# Altium schematic sheet Sheet1.SchDoc
size 209 x 297 mm; Scale: 1:1; Разраб.: Косяков Д.; Пров.: Гюльмалиев Э.; Утв.: Гюльмалиев Э.; Номер листа: 2; Общее количество листов: 2; Наименование организации: ГБПОУ "1-й МОК"; Наименование изделия 1: Плата; Наименование изделия 2: Схема электрическая; Наименование изделия 3: принципиальная; Нач. отд.: Науч.рук; Фамилия нач. отд.: Гюльмалиев Э.
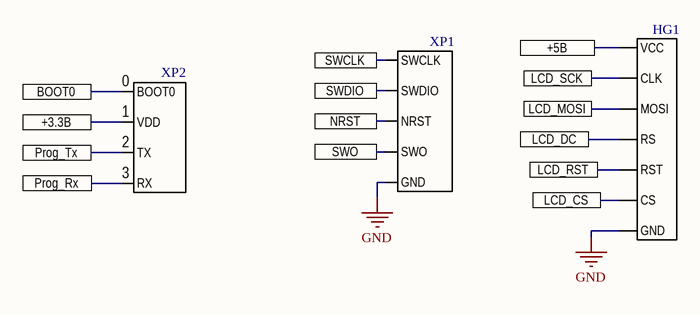
[diagram p0: Sheet1.SchDoc]

## Parts
HG1  TFT_SPI  [LCD_TFT_SPI]  (value not drawn)
XP1  SWD  [SWD]  (value not drawn)
XP2  UART  [UART]  (value not drawn)

## Ports
+3.3В, +5В, BOOT0, LCD_CS, LCD_DC, LCD_MOSI, LCD_RST, LCD_SCK, NRST, Prog_Rx, Prog_Tx, SWCLK, SWDIO, SWO

## Nets
GND: HG1.2(GND) XP1.1(GND)
+3.3В: XP2.1(VDD) ; port +3.3В
+5В: HG1.1(VCC) ; port +5В
BOOT0: XP2.0(BOOT0) ; port BOOT0
LCD_CS: HG1.7(CS) ; port LCD_CS
LCD_DC: HG1.5(RS) ; port LCD_DC
LCD_MOSI: HG1.4(MOSI) ; port LCD_MOSI
LCD_RST: HG1.6(RST) ; port LCD_RST
LCD_SCK: HG1.3(CLK) ; port LCD_SCK
NRST: XP1.3(NRST) ; port NRST
Prog_Rx: XP2.3(RX) ; port Prog_Rx
Prog_Tx: XP2.2(TX) ; port Prog_Tx
SWCLK: XP1.0(SWCLK) ; port SWCLK
SWDIO: XP1.2(SWDIO) ; port SWDIO
SWO: XP1.4(SWO) ; port SWO

## Notes on the sheet
- Перв. примен.
- Справ. №
- Подп. и дата
- Инв. № дубл.
- Взам. инв. №
- Разраб.
- Изм.
- Лист
- № докум.
- Подп.
- Дата
- Лит.
- Масса
- Масштаб
- Пров.
- Т.контр.
- Листов
- Инв. № подл.
- Утв.
- Н.контр.
- Копировал
- Формат А4